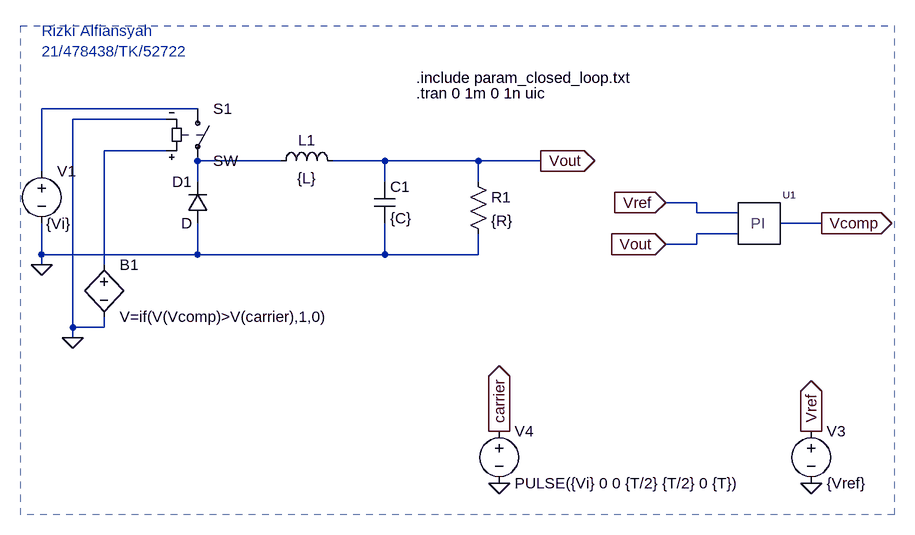
[diagram p0: schematic Closed-Loop_Buck-Converter.asc]
Closed-Loop_Buck-Converter.asc, the LTspice schematic file:
Version 4
SHEET 1 1928 712
WIRE 336 32 96 32
WIRE 288 48 144 48
WIRE 288 96 192 96
WIRE 464 112 336 112
WIRE 624 112 544 112
WIRE 768 112 624 112
WIRE 864 112 768 112
WIRE 96 128 96 32
WIRE 336 144 336 112
WIRE 624 144 624 112
WIRE 768 144 768 112
WIRE 1104 176 1056 176
WIRE 1104 192 1104 176
WIRE 1168 192 1104 192
WIRE 1296 208 1232 208
WIRE 1168 224 1104 224
WIRE 1104 240 1104 224
WIRE 1104 240 1056 240
WIRE 96 256 96 208
WIRE 336 256 336 208
WIRE 336 256 96 256
WIRE 624 256 624 208
WIRE 624 256 336 256
WIRE 768 256 768 224
WIRE 768 256 624 256
WIRE 96 272 96 256
WIRE 192 272 192 96
WIRE 144 368 144 48
WIRE 192 368 192 352
WIRE 192 368 144 368
WIRE 144 384 144 368
FLAG 96 272 0
FLAG 1280 608 0
FLAG 1280 528 Vref
IOPIN 1280 528 Out
FLAG 800 608 0
FLAG 144 384 0
FLAG 800 528 carrier
IOPIN 800 528 Out
FLAG 864 112 Vout
IOPIN 864 112 Out
FLAG 1056 240 Vout
IOPIN 1056 240 In
FLAG 1056 176 Vref
IOPIN 1056 176 In
FLAG 1296 208 Vcomp
IOPIN 1296 208 Out
SYMBOL voltage 96 112 R0
WINDOW 3 7 97 Left 2
WINDOW 123 0 0 Left 0
WINDOW 39 0 0 Left 0
SYMATTR Value {Vi}
SYMATTR InstName V1
SYMBOL diode 352 208 R180
WINDOW 0 24 64 Left 2
WINDOW 3 24 0 Left 2
SYMATTR InstName D1
SYMBOL cap 608 144 R0
SYMATTR InstName C1
SYMATTR Value {C}
SYMBOL res 752 128 R0
SYMATTR InstName R1
SYMATTR Value {R}
SYMBOL ind 448 128 R270
WINDOW 0 32 56 VTop 2
WINDOW 3 5 56 VBottom 2
SYMATTR InstName L1
SYMATTR Value {L}
SYMBOL sw 336 16 R0
SYMATTR InstName S1
SYMBOL voltage 1280 512 R0
WINDOW 123 0 0 Left 0
WINDOW 39 0 0 Left 0
SYMATTR InstName V3
SYMATTR Value {Vref}
SYMBOL voltage 800 512 R0
WINDOW 123 0 0 Left 0
WINDOW 39 0 0 Left 0
SYMATTR InstName V4
SYMATTR Value PULSE({Vi} 0 0 {T/2} {T/2} 0 {T})
SYMBOL bv 192 256 R0
SYMATTR InstName B1
SYMATTR Value V=if(V(Vcomp)>V(carrier),1,0)
SYMBOL picontrol 1200 208 R0
SYMATTR InstName U1
SYMATTR Value Kp=2.7
SYMATTR Value2 Ki=5000
TEXT 672 8 Left 2 !.tran 0 1m 0 1n uic
TEXT 672 -16 Left 2 !.include param_closed_loop.txt
TEXT 96 -88 Left 2 ;Rizki Alfiansyah\n21/478438/TK/52722
RECTANGLE Normal 1408 656 64 -96 2

The netlist it stands for:
* Closed-Loop_Buck-Converter.asc
V1 N001 0 {Vi}
D1 0 N003 D
C1 Vout 0 {C}
R1 Vout 0 {R}
L1 N003 Vout {L}
S1 N001 N003 N002 0 SW
V3 Vref 0 {Vref}
V4 carrier 0 PULSE({Vi} 0 0 {T/2} {T/2} 0 {T})
B1 N002 0 V=if(V(Vcomp)>V(carrier),1,0)
XU1 Vref Vout Vcomp PIcontrol Kp=2.7 Ki=5000  ; pins 1 2 3
.model D D
.lib standard.dio
.tran 0 1m 0 1n uic
.include param_closed_loop.txt
* Rizki Alfiansyah
* 21/478438/TK/52722
.lib PI.lib
.backanno
.end